# Altium project VNA_BASE_PRO.PrjPcb
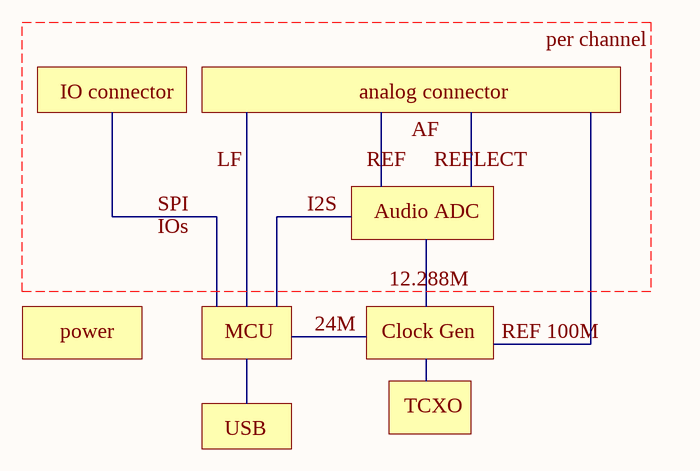
[diagram p0: block_diagram.SchDoc]
3 sheets, 10 parts. Net scope: global (net labels, ports and power ports of the same name join across sheets).
Board file: VNA_BASE_PRO.PcbDoc
Sheets:
  block_diagram.SchDoc
  connector.SchDoc
  power.SchDoc

## Sheet block_diagram.SchDoc
size A4

### Notes on the sheet
- per channel
- IO connector
- LF
- analog connector
- REF
- AF
- REFLECT
- SPI
- IOs
- I2S
- Audio ADC
- 12.288M
- power
- MCU
- 24M
- Clock Gen
- REF 100M
- USB
- TCXO

## Sheet connector.SchDoc
size A4
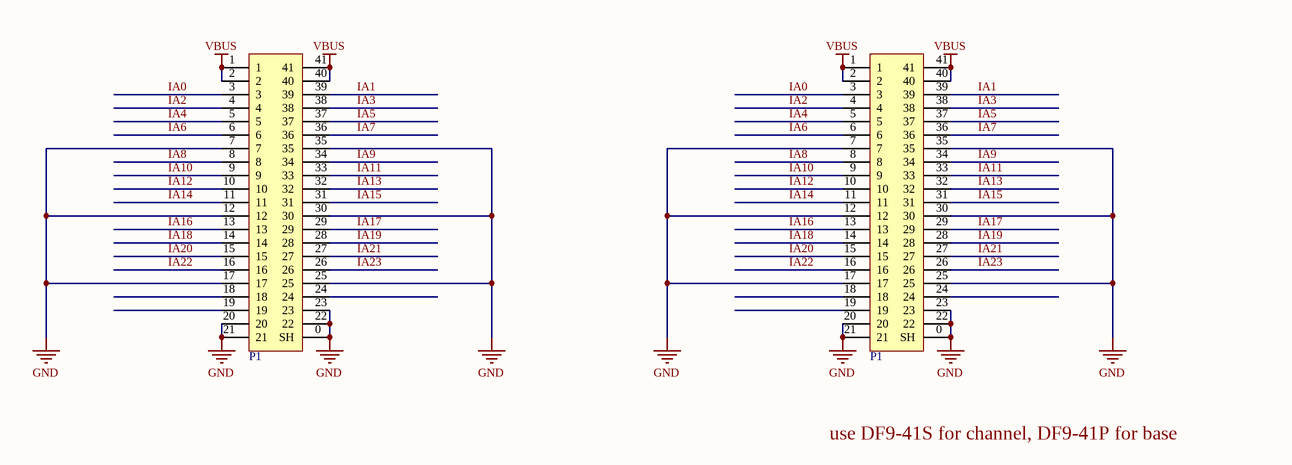
[diagram p1: connector.SchDoc]

### Parts
(Parts that share a designator on the sheet are numbered #1, #2 ... from top to bottom, then left to right.)
P1#1  DF9-41S  [DF9-41S]  (value not drawn)
P1#2  DF9-41S  [DF9-41S]  (value not drawn)

### Nets
GND: P1#1.0(SH) P1#1.7 P1#1.12 P1#1.17 P1#1.20 P1#1.21 P1#1.22 P1#1.23 P1#1.25 P1#1.30 P1#1.35 P1#2.0(SH) P1#2.7 P1#2.12 P1#2.17 P1#2.20 P1#2.21 P1#2.22 P1#2.23 P1#2.25 P1#2.30 P1#2.35
VBUS: P1#1.1 P1#1.2 P1#1.40 P1#1.41 P1#2.1 P1#2.2 P1#2.40 P1#2.41
IA0: P1#1.3 P1#2.3
IA1: P1#1.39 P1#2.39
IA2: P1#1.4 P1#2.4
IA3: P1#1.38 P1#2.38
IA4: P1#1.5 P1#2.5
IA5: P1#1.37 P1#2.37
IA6: P1#1.6 P1#2.6
IA7: P1#1.36 P1#2.36
IA8: P1#1.8 P1#2.8
IA9: P1#1.34 P1#2.34
IA10: P1#1.9 P1#2.9
IA11: P1#1.33 P1#2.33
IA12: P1#1.10 P1#2.10
IA13: P1#1.32 P1#2.32
IA14: P1#1.11 P1#2.11
IA15: P1#1.31 P1#2.31
IA16: P1#1.13 P1#2.13
IA17: P1#1.29 P1#2.29
IA18: P1#1.14 P1#2.14
IA19: P1#1.28 P1#2.28
IA20: P1#1.15 P1#2.15
IA21: P1#1.27 P1#2.27
IA22: P1#1.16 P1#2.16
IA23: P1#1.26 P1#2.26

Not connected (* = marked no-connect by the designer): P1#1 18 19 24; P1#2 18 19 24

### Notes on the sheet
- use DF9-41S for channel, DF9-41P for base

## Sheet power.SchDoc
size A4
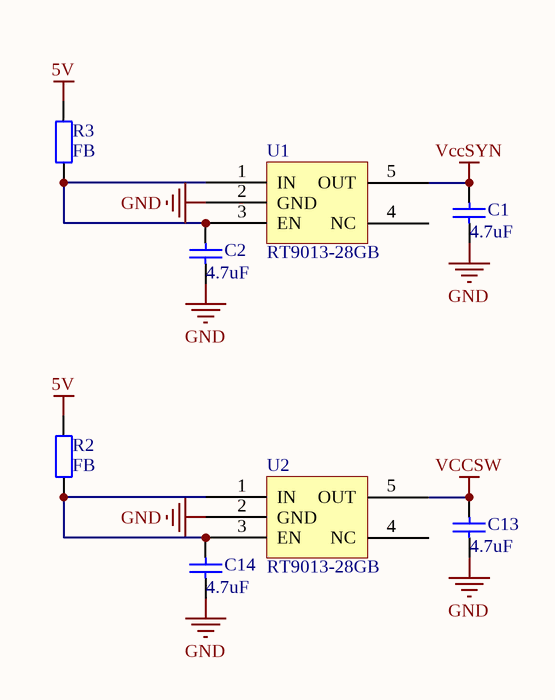
[diagram p2: power.SchDoc]

### Parts
C1  4.7uF  [0603]
C2  4.7uF  [0603]
C13  4.7uF  [0603]
C14  4.7uF  [0603]
R2  FB  [0603]
R3  FB  [0603]
U1  RT9013-28GB  [SOT23-5]
U2  RT9013-28GB  [SOT23-5]

### Nets
5V: R2.2 R3.2
GND: C1.1 C2.1 C13.1 C14.1 U1.2(GND) U2.2(GND)
VCCSW: C13.2 U2.5(OUT)
VccSYN: C1.2 U1.5(OUT)
NetC2_2: C2.2 R3.1 U1.1(IN) U1.3(EN)
NetC14_2: C14.2 R2.1 U2.1(IN) U2.3(EN)

Not connected (* = marked no-connect by the designer): U1 4(NC); U2 4(NC)

### Library data of the parts
C1 C2 C13 C14 = Cap: Capacitor; Published: 8-Jun-2000; LatestRevisionDate: 17-Jul-2002; LatestRevisionNote: Re-released for DXP Platform.; PackageReference: RAD-0.3; Publisher: Altium Limited; PackageDescription: Radial Cap, Thru-Hole; 2 Leads; 0.3 in Pin Spacing
R2 R3 = Res2: Resistor; Value: 0Ohm; Published: 8-Jun-2000; LatestRevisionDate: 17-Jul-2002; LatestRevisionNote: Re-released for DXP Platform.; PackageReference: AXIAL-0.4; Publisher: Altium Limited; PackageDescription: Axial Device, Thru-Hole; 2 Leads; 0.4 in Pin Spacing
U1 U2 = LP5907

## Nets that join several sheets
GND: connector (22 pins), power (6 pins)